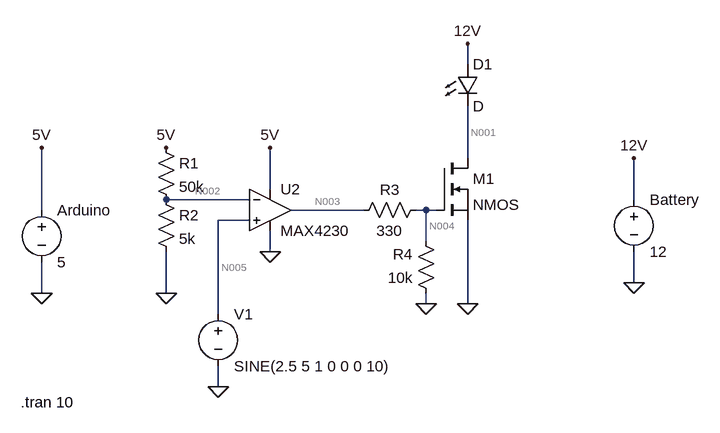
[diagram p0: schematic TestSim.asc]
TestSim.asc, the LTspice schematic file:
Version 4
SHEET 1 1072 680
WIRE 704 -80 704 -112
WIRE 704 64 704 -16
WIRE 400 112 400 48
WIRE 368 128 240 128
WIRE 960 128 960 64
WIRE 48 144 48 48
WIRE 544 144 432 144
WIRE 640 144 624 144
WIRE 656 144 640 144
WIRE 368 160 320 160
WIRE 640 192 640 144
WIRE 400 208 400 176
WIRE 960 256 960 208
WIRE 48 272 48 224
WIRE 240 272 240 208
WIRE 640 288 640 272
WIRE 704 288 704 160
WIRE 320 304 320 160
WIRE 320 416 320 384
FLAG 48 272 0
FLAG 960 256 0
FLAG 400 208 0
FLAG 48 48 5V
FLAG 400 48 5V
FLAG 960 64 12V
FLAG 240 272 0
FLAG 240 48 5V
FLAG 320 416 0
FLAG 640 288 0
FLAG 704 288 0
FLAG 704 -112 12V
SYMBOL voltage 48 128 R0
WINDOW 123 0 0 Left 0
WINDOW 39 0 0 Left 0
SYMATTR InstName Arduino
SYMATTR Value 5
SYMBOL voltage 960 112 R0
WINDOW 123 0 0 Left 0
WINDOW 39 0 0 Left 0
SYMATTR InstName Battery
SYMATTR Value 12
SYMBOL res 224 32 R0
SYMATTR InstName R1
SYMATTR Value 50k
SYMBOL res 224 112 R0
SYMATTR InstName R2
SYMATTR Value 5k
SYMBOL voltage 320 288 R0
WINDOW 123 0 0 Left 0
WINDOW 39 0 0 Left 0
SYMATTR InstName V1
SYMATTR Value SINE(2.5 5 1 0 0 0 10)
SYMBOL nmos 656 64 R0
SYMATTR InstName M1
SYMBOL res 640 128 R90
WINDOW 0 0 56 VBottom 2
WINDOW 3 32 56 VTop 2
SYMATTR InstName R3
SYMATTR Value 330
SYMBOL res 656 288 R180
WINDOW 0 36 76 Left 2
WINDOW 3 36 40 Left 2
SYMATTR InstName R4
SYMATTR Value 10k
SYMBOL LED 688 -80 R0
SYMATTR InstName D1
SYMBOL OpAmps\\MAX4230 400 80 R0
SYMATTR InstName U2
TEXT 16 440 Left 2 !.tran 10

The netlist it stands for:
* TestSim.asc
V§Arduino 5V 0 5
V§Battery 12V 0 12
R1 5V N002 50k
R2 N002 0 5k
V1 N005 0 SINE(2.5 5 1 0 0 0 10)
M1 N001 N004 0 0 NMOS
R3 N004 N003 330
R4 0 N004 10k
D1 12V N001 D
XU2 N005 N002 5V 0 N003 MAX4230  ; pins In+ In- V+ V- OUT
.model D D
.lib standard.dio
.model NMOS NMOS
.model PMOS PMOS
.lib standard.mos
.tran 10
.lib MAX4230.lib
.backanno
.end

* Results of the author's LTspice run, read from the files saved beside the schematic
* Operating Point, zero values left out:
*   V(5v) = 5 V
*   V(12v) = 12 V
*   V(n002) = 454.5 mV
*   V(n005) = 2.5 V
*   V(n001) = 11.38 V
*   V(n004) = 4.836 V
*   V(n003) = 4.995 V
*   Id(M1) = 233.9 µA
*   Ib(M1) = -11.39 pA
*   Is(M1) = -233.9 µA
*   I(D1) = 233.9 µA
*   I(R1) = 90.91 µA
*   I(R2) = 90.91 µA
*   I(R3) = -483.6 µA
*   I(R4) = -483.6 µA
*   I(Arduino) = -1.754 mA
*   I(Battery) = -233.9 µA
*   I(V1) = -2.528 nA
*   Ix(u2:1) = 2.528 nA
*   Ix(u2:2) = 428 pA
*   Ix(u2:3) = 1.664 mA
*   Ix(u2:4) = -1.18 mA
*   Ix(u2:5) = -483.6 µA
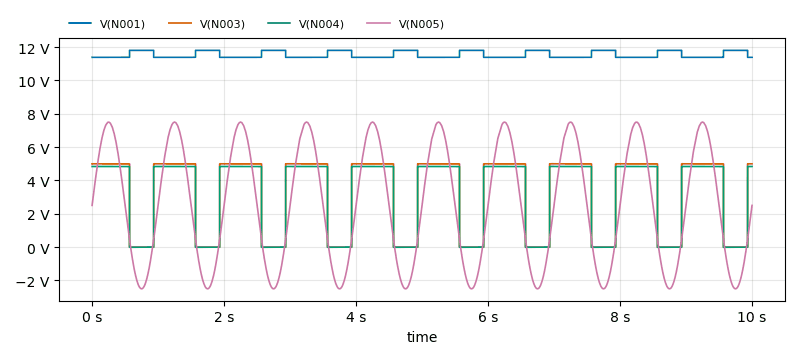
[diagram p1: Transient Analysis of TestSim.asc, plotted from the saved traces]
* Transient Analysis, 1 run:
*   V(N001): min 11.38 V, max 11.8 V, average 11.53 V, rms 11.54 V, last 11.38 V
*   V(N003): min -6.527 mV, max 5.001 V, average 3.166 V, rms 3.979 V, last 4.995 V
*   V(N004): min -6.318 mV, max 4.841 V, average 3.065 V, rms 3.851 V, last 4.836 V
*   V(N005): min -2.5 V, max 7.5 V, average 2.493 V, rms 4.329 V, last 2.5 V